# EAGLE design controller (EAGLE 9.5.2)

## Sheet 1 of 5: Power
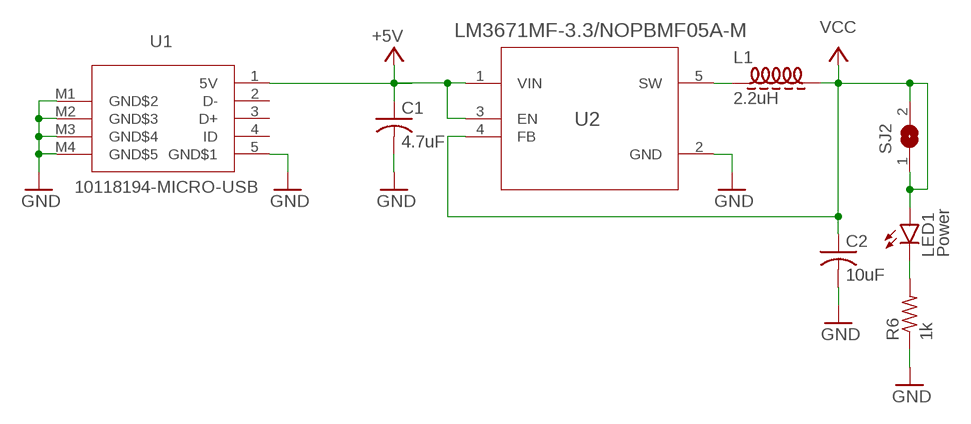
[diagram p0: schematic, sheet 1]

### Parts
C1  4.7uF  C-USC0805  [C0805]
C2  10uF  C-USC0805  [C0805]
L1  2.2uH  IND-0805  [R0805]
LED1  Power  LEDCHIPLED_0805  [CHIPLED_0805]
R6  1k  R-US_R0805  [R0805]
SJ2  SJ  [SJ]
U1  10118194-MICRO-USB  [10118194-MICRO-USB]
U2  LM3671MF-3.3/NOPBMF05A-M  [MF05A-M]

### Nets
+5V: C1.1 U1.1(5V) U2.1(VIN) U2.3(EN) ; also sheet 3
GND: C1.2 C2.2 R6.1 U1.5(GND$1) U1.M1(GND$2) U1.M2(GND$3) U1.M3(GND$4) U1.M4(GND$5) U2.2(GND) ; also sheet 2,3,4,5
N$1: L1.1 U2.5(SW)
N$10: LED1.C R6.2
VCC: C2.1 L1.2 LED1.A SJ2.1 SJ2.2 U2.4(FB) ; also sheet 2,3,4,5
Unconnected: U1.2(D-) U1.3(D+) U1.4(ID)

## Sheet 2 of 5: ESP
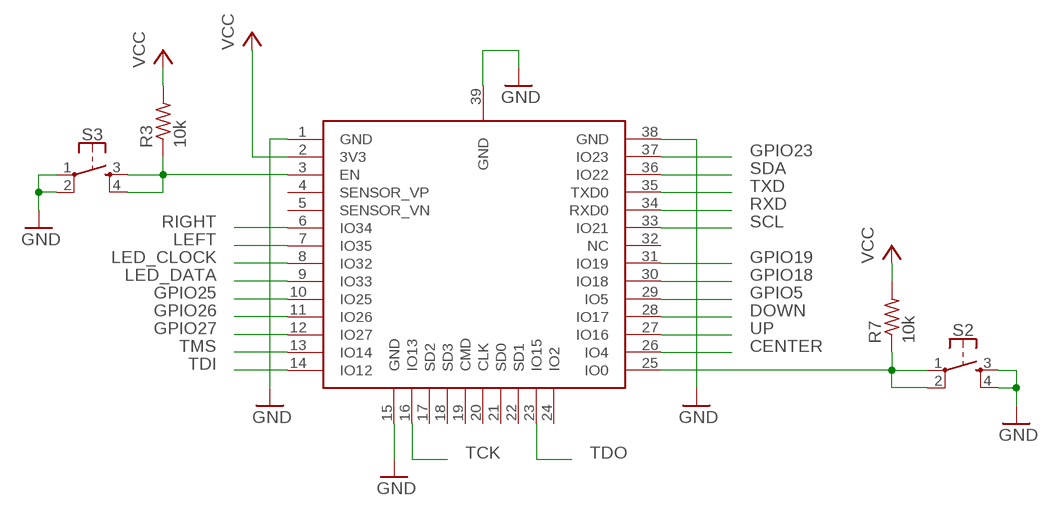
[diagram p1: schematic, sheet 2]

### Parts
R3  10k  R-US_R0805  [R0805]
R7  10k  R-US_R0805  [R0805]
S2  MOMENTARY-SWITCH-SPST-2-SMD-4.6X2.8MM  [TACTILE_SWITCH_SMD_4.6X2.8MM]
S3  MOMENTARY-SWITCH-SPST-2-SMD-4.6X2.8MM  [TACTILE_SWITCH_SMD_4.6X2.8MM]
U$2  ESP32-WROOM-32D  [ESP32-WROOM-32D]

### Nets
CENTER: U$2.26(IO4) ; also sheet 4
DOWN: U$2.28(IO17) ; also sheet 4
EN: R3.1 S3.3 S3.4 U$2.3(EN)
GND: S2.3 S2.4 S3.1 S3.2 U$2.1(GND) U$2.15(GND) U$2.38(GND) U$2.39(GND) ; also sheet 1,3,4,5
GPIO5: U$2.29(IO5) ; also sheet 5
GPIO18: U$2.30(IO18) ; also sheet 5
GPIO19: U$2.31(IO19) ; also sheet 5
GPIO23: U$2.37(IO23) ; also sheet 5
GPIO25: U$2.10(IO25) ; also sheet 5
GPIO26: U$2.11(IO26) ; also sheet 5
GPIO27: U$2.12(IO27) ; also sheet 5
IO0: R7.1 S2.1 S2.2 U$2.25(IO0)
LED_CLOCK: U$2.8(IO32) ; also sheet 3
LED_DATA: U$2.9(IO33) ; also sheet 3
LEFT: U$2.7(IO35) ; also sheet 4
RIGHT: U$2.6(IO34) ; also sheet 4
RXD: U$2.34(RXD0) ; also sheet 5
SCL: U$2.33(IO21) ; also sheet 4
SDA: U$2.36(IO22) ; also sheet 4
TCK: U$2.16(IO13) ; also sheet 5
TDI: U$2.14(IO12) ; also sheet 5
TDO: U$2.23(IO15) ; also sheet 5
TMS: U$2.13(IO14) ; also sheet 5
TXD: U$2.35(TXD0) ; also sheet 5
UP: U$2.27(IO16) ; also sheet 4
VCC: R3.2 R7.2 U$2.2(3V3) ; also sheet 1,3,4,5
Unconnected: U$2.4(SENSOR_VP) U$2.5(SENSOR_VN) U$2.17(SD2) U$2.18(SD3) U$2.19(CMD) U$2.20(CLK) U$2.21(SD0) U$2.22(SD1) U$2.24(IO2) U$2.32(NC)

## Sheet 3 of 5: LED
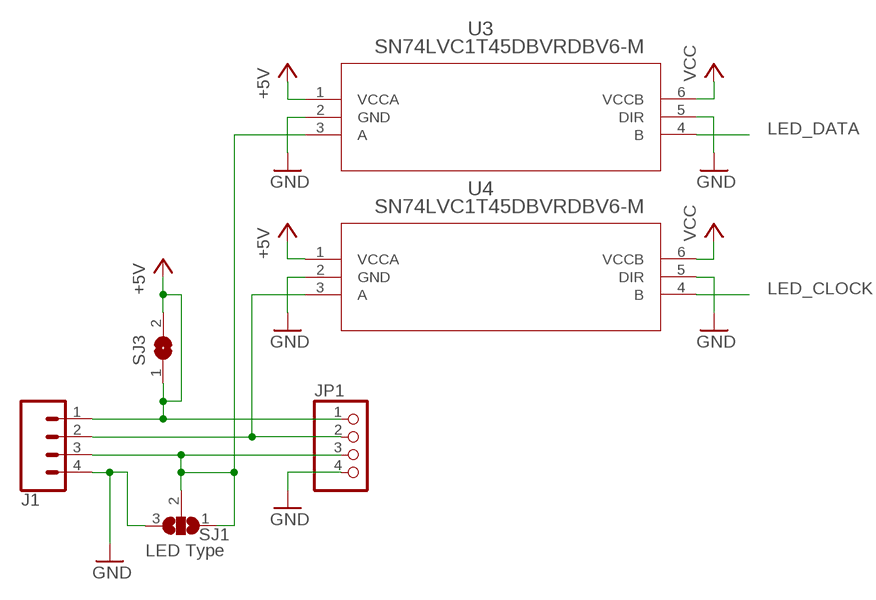
[diagram p2: schematic, sheet 3]

### Parts
J1  CONN_04SCREW  [SCREWTERMINAL-3.5MM-4]
JP1  PINHD-1X4  [1X04]
SJ1  LED Type  SJ2W  [SJ_2]
SJ3  SJ  [SJ]
U3  SN74LVC1T45DBVRDBV6-M  [DBV6-M]
U4  SN74LVC1T45DBVRDBV6-M  [DBV6-M]

### Nets
+5V: J1.1 JP1.1 SJ3.1 SJ3.2 U3.1(VCCA) U4.1(VCCA) ; also sheet 1
GND: J1.4 JP1.4 SJ1.3 U3.2(GND) U3.5(DIR) U4.2(GND) U4.5(DIR) ; also sheet 1,2,4,5
LED_CLOCK: U4.4(B) ; also sheet 2
LED_DATA: U3.4(B) ; also sheet 2
N$7: J1.3 JP1.3 SJ1.1 SJ1.2 U3.3(A)
N$9: J1.2 JP1.2 U4.3(A)
VCC: U3.6(VCCB) U4.6(VCCB) ; also sheet 1,2,4,5

## Sheet 4 of 5: UI
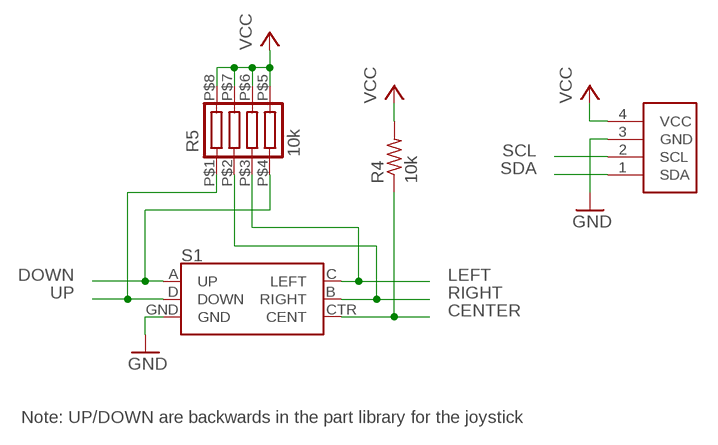
[diagram p3: schematic, sheet 4]

### Parts
R4  10k  R-US_R0805  [R0805]
R5  10k  744C083  [2012-4N-CONCAVE]
S1  JOYSTICK_MINI  [JOYSTICK_MINI]
U$5  SSD1306-OLED  [SSD1306-OLED]

### Nets
CENTER: R4.1 S1.CTR(CENT) ; also sheet 2
DOWN: R5.P$4 S1.A(UP) ; also sheet 2
GND: S1.GND U$5.3(GND) ; also sheet 1,2,3,5
LEFT: R5.P$3 S1.C(LEFT) ; also sheet 2
RIGHT: R5.P$2 S1.B(RIGHT) ; also sheet 2
SCL: U$5.2(SCL) ; also sheet 2
SDA: U$5.1(SDA) ; also sheet 2
UP: R5.P$1 S1.D(DOWN) ; also sheet 2
VCC: R4.2 R5.P$5 R5.P$6 R5.P$7 R5.P$8 U$5.4(VCC) ; also sheet 1,2,3,5

### Notes on the sheet
- Note: UP/DOWN are backwards in the part library for the joystick

## Sheet 5 of 5: Extension Headers
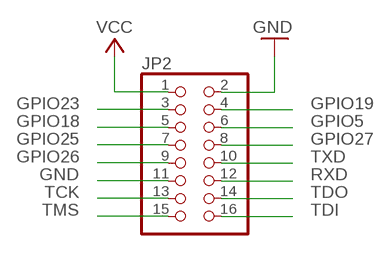
[diagram p4: schematic, sheet 5]

### Parts
JP2  PINHD-2X8  [2X08]

### Nets
GND: JP2.2 JP2.11 ; also sheet 1,2,3,4
GPIO5: JP2.6 ; also sheet 2
GPIO18: JP2.5 ; also sheet 2
GPIO19: JP2.4 ; also sheet 2
GPIO23: JP2.3 ; also sheet 2
GPIO25: JP2.7 ; also sheet 2
GPIO26: JP2.9 ; also sheet 2
GPIO27: JP2.8 ; also sheet 2
RXD: JP2.12 ; also sheet 2
TCK: JP2.13 ; also sheet 2
TDI: JP2.16 ; also sheet 2
TDO: JP2.14 ; also sheet 2
TMS: JP2.15 ; also sheet 2
TXD: JP2.10 ; also sheet 2
VCC: JP2.1 ; also sheet 1,2,3,4

## Library data of the parts
C1 C2 = rcl:C-US: CAPACITOR, American symbol; SPICEPREFIX: C
J1 = SparkFun-Connectors:CONN_04: Multi connection point. Often used as Generic Header-pin footprint for 0.1 inch spaced/style header connections On any of the 0.1 inch spaced packages, you can populate with these: Break Away Headers - Straight <https://www.sparkfun.com/products/116> (PRT-00116) Break Away Male Headers - Right Angle <https://www.sparkfun.com/products/553> (PRT-00553) Female Headers <https://www.sparkfun.com/products/115> (PRT-00115) Break Away Headers - Machine Pin <https://www.sparkfun.com/products/117> (PRT-00117) Break Away Female Headers - Swiss Machine Pin <https://www.sparkfun.com/products/743> (PRT-00743) For SCREWTERMINALS and SPRING TERMINALS visit here: Screw Terimnals on SparkFun.com <https://www.sparkfun.com/search/results?term=Screw+Terminals> (5mm/3.5mm/2.54mm spacing) This device is also useful as a general connection point to wire up your design to another part of your project. Our various solder wires solder well into these plated through hole pads. Hook-Up Wire - Assortment (Stranded, 22 AWG) <https://www.sparkfun.com/products/11375> (PRT-11375) Hook-Up Wire - Assortment (Solid Core, 22 AWG) <https://www.sparkfun.com/products/11367> (PRT-11367) View the entire wire category on our website here <https://www.sparkfun.com/categories/141> Special notes: Molex polarized connector foot print use with SKU : PRT-08231 with associated crimp pins and housings. 1MM SMD Version SKU: PRT-10208; PROD_ID: 2xCONN-08399; SF_ID: 2xPRT-08084
JP1 = pinhead:PINHD-1X4: PIN HEADER
JP2 = pinhead:PINHD-2X8: PIN HEADER
L1 = nebrius:IND-0805
LED1 = led:LED: LED OSRAM: - CHIPLED LG R971, LG N971, LY N971, LG Q971, LY Q971, LO R971, LY R971 LH N974, LH R974 LS Q976, LO Q976, LY Q976 LO Q996 - Hyper CHIPLED LW Q18S LB Q993, LB Q99A, LB R99A - SideLED LS A670, LO A670, LY A670, LG A670, LP A670 LB A673, LV A673, LT A673, LW A673 LH A674 LY A675 LS A676, LA A676, LO A676, LY A676, LW A676 LS A679, LY A679, LG A679 - Hyper Micro SIDELED® LS Y876, LA Y876, LO Y876, LY Y876 LT Y87S - SmartLED LW L88C, LW L88S LB L89C, LB L89S, LG L890 LS L89K, LO L89K, LY L89K LS L896, LA L896, LO L896, LY L896 - TOPLED LS T670, LO T670, LY T670, LG T670, LP T670 LSG T670, LSP T670, LSY T670, LOP T670, LYG T670 LG T671, LOG T671, LSG T671 LB T673, LV T673, LT T673, LW T673 LH T674 LS T676, LA T676, LO T676, LY T676, LB T676, LH T676, LSB T676, LW T676 LB T67C, LV T67C, LT T67C, LS T67K, LO T67K, LY T67K, LW E67C LS E67B, LA E67B, LO E67B, LY E67B, LB E67C, LV E67C, LT E67C LW T67C LS T679, LY T679, LG T679 LS T770, LO T770, LY T770, LG T770, LP T770 LB T773, LV T773, LT T773, LW T773 LH T774 LS E675, LA E675, LY E675, LS T675 LS T776, LA T776, LO T776, LY T776, LB T776 LHGB T686 LT T68C, LB T68C - Hyper Mini TOPLED® LB M676 - Mini TOPLED Santana® LG M470 LS M47K, LO M47K, LY M47K Source: http://www.osram.convergy.de LUXEON: - LUMILED® LXK2-PW12-R00, LXK2-PW12-S00, LXK2-PW14-U00, LXK2-PW14-V00 LXK2-PM12-R00, LXK2-PM12-S00, LXK2-PM14-U00 LXK2-PE12-Q00, LXK2-PE12-R00, LXK2-PE12-S00, LXK2-PE14-T00, LXK2-PE14-U00 LXK2-PB12-K00, LXK2-PB12-L00, LXK2-PB12-M00, LXK2-PB14-N00, LXK2-PB14-P00, LXK2-PB14-Q00 LXK2-PR12-L00, LXK2-PR12-M00, LXK2-PR14-Q00, LXK2-PR14-R00 LXK2-PD12-Q00, LXK2-PD12-R00, LXK2-PD12-S00 LXK2-PH12-R00, LXK2-PH12-S00 LXK2-PL12-P00, LXK2-PL12-Q00, LXK2-PL12-R00 Source: www.luxeon.com KINGBRIGHT: KA-3528ASYC Source: www.kingbright.com
R3 R4 R6 R7 = rcl:R-US_: RESISTOR, American symbol; SPICEPREFIX: R
R5 = nebrius:744C083
S1 = SparkFun-Switches:JOYSTICK_MINI: Small Tactile Joystick w/ Select Switch A 5-way tactile switch allows for a joystick-like interface in a very small package. Part #: 4UCON SF303GJ26 SparkFun Products 5-way Tactile Switch <https://www.sparkfun.com/products/10063> (COM-10063) Used on SparkFun Block for Intel® Edison - OLED <https://www.sparkfun.com/products/13035> (DEV-13035) Used on CAN-BUS Shield <https://www.sparkfun.com/products/13262> (DEV-13262); PROD_ID: SWCH-09905; SF_SKU: COM-10063
S2 S3 = SparkFun-Switches:MOMENTARY-SWITCH-SPST-2: Momentary Switch (Pushbutton) - SPST - Two Circuits Normally-open (NO) SPST momentary switches (buttons, pushbuttons). Schematic symbol includes two switch circuits. Variants SMD-4.6MMX2.8MM - 4.60mm x 2.80mm Tactile Momentary Button Switch - Used on SparkFun SAMD21 Mini Breakout <https://www.sparkfun.com/products/13664> SMD-5.2MM - Mini Pushbutton Switch - SMD <https://www.sparkfun.com/products/8720> - Used on Arduino Pro Mini <https://www.sparkfun.com/products/11114>; PROD_ID: SWCH-13065
SJ1 = jumper:SJ2W: SMD solder JUMPER
SJ2 SJ3 = jumper:SJ: SMD solder JUMPER
U1 = nebrius:10118194-MICRO-USB: Surface mount micro USB connector
U2 = nebrius:LM3671MF-3.3/NOPB; MANUFACTURER_PART_NUMBER: LM3671MF3.3NOPB; VENDOR: Texas Instruments
U3 U4 = nebrius:SN74LVC1T45DBVR; MANUFACTURER_PART_NUMBER: SN74LVC1T45DBVR; VENDOR: Texas Instruments
U$2 = nebrius:ESP32-WROOM-32D
U$5 = nebrius:SSD1306-OLED

## Board
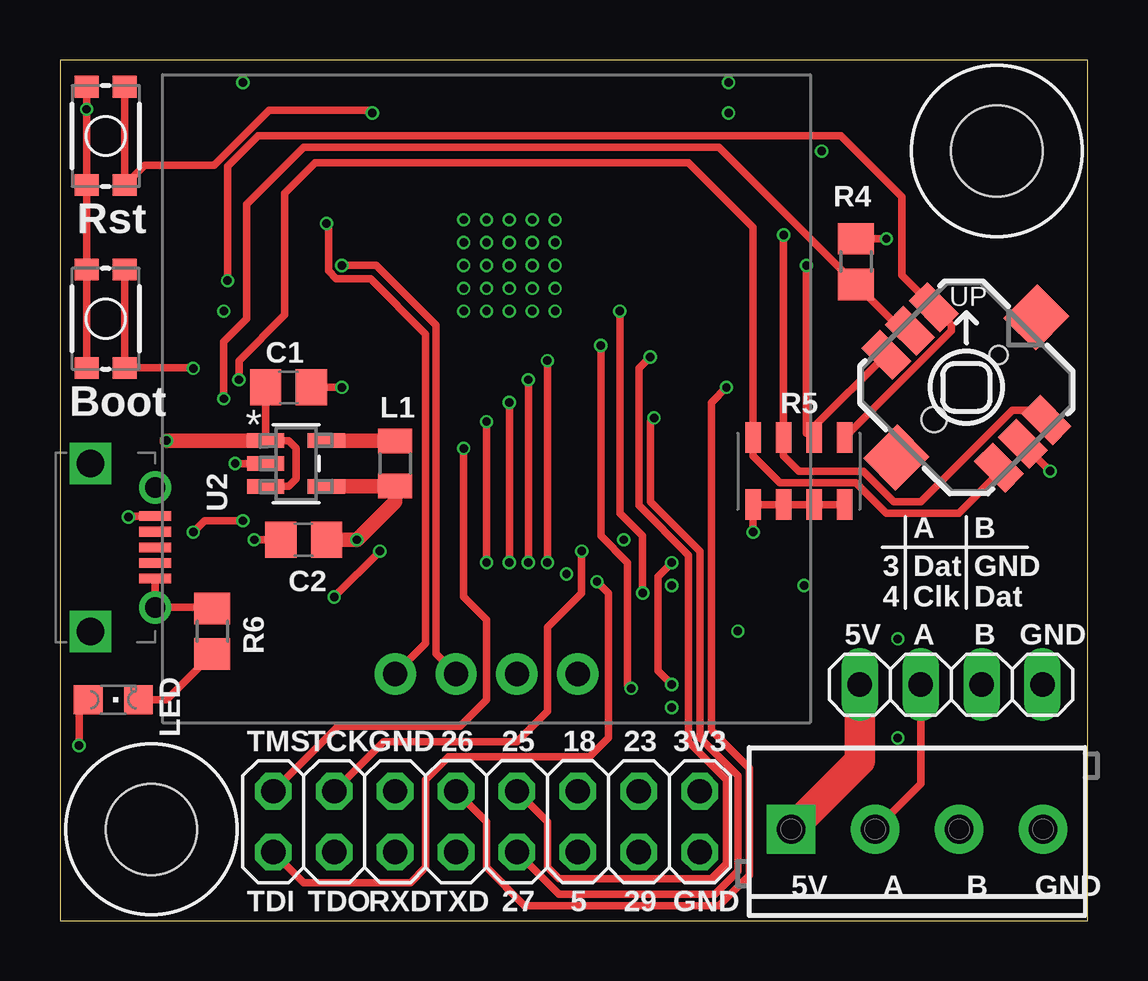
[diagram p5: board, top side]
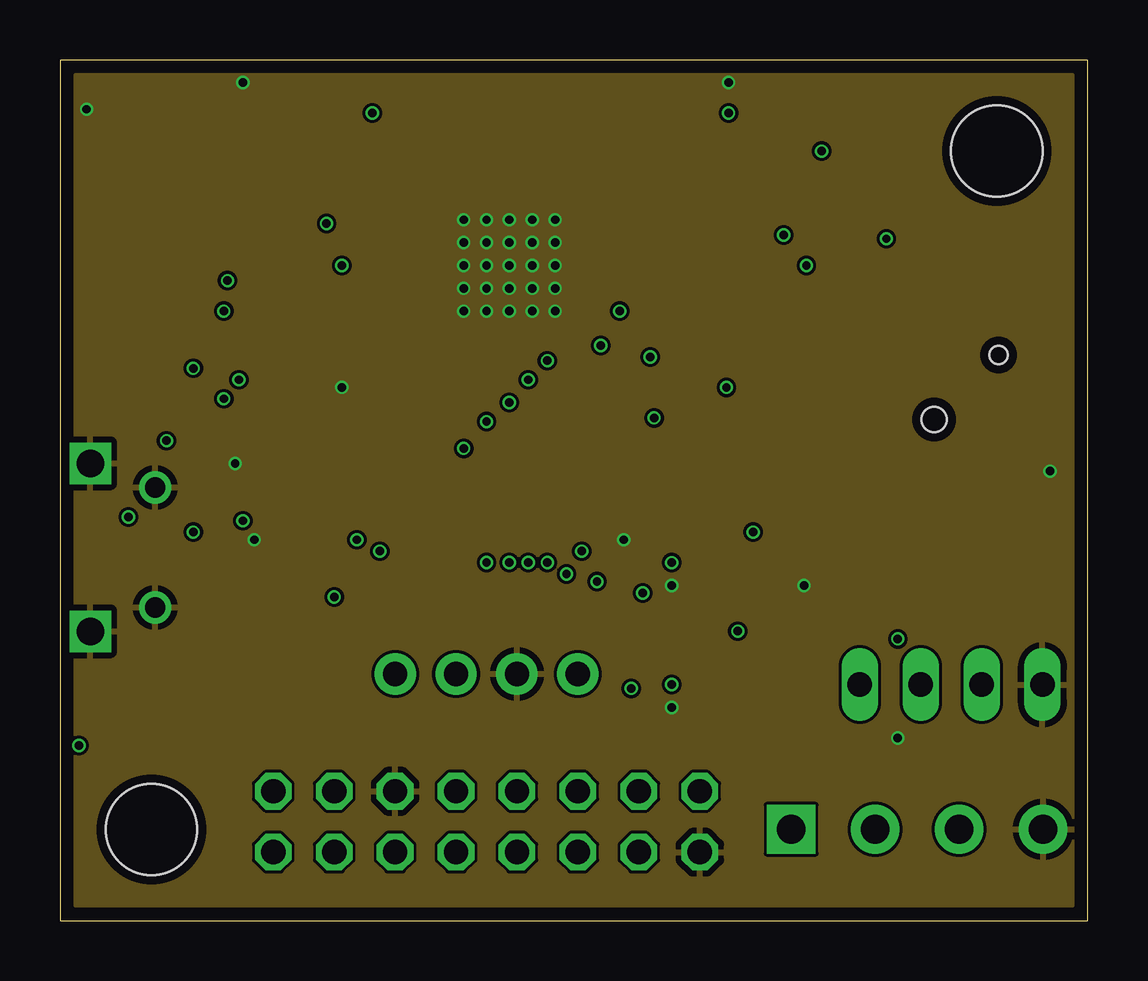
[diagram p6: board, inner layer Route2]
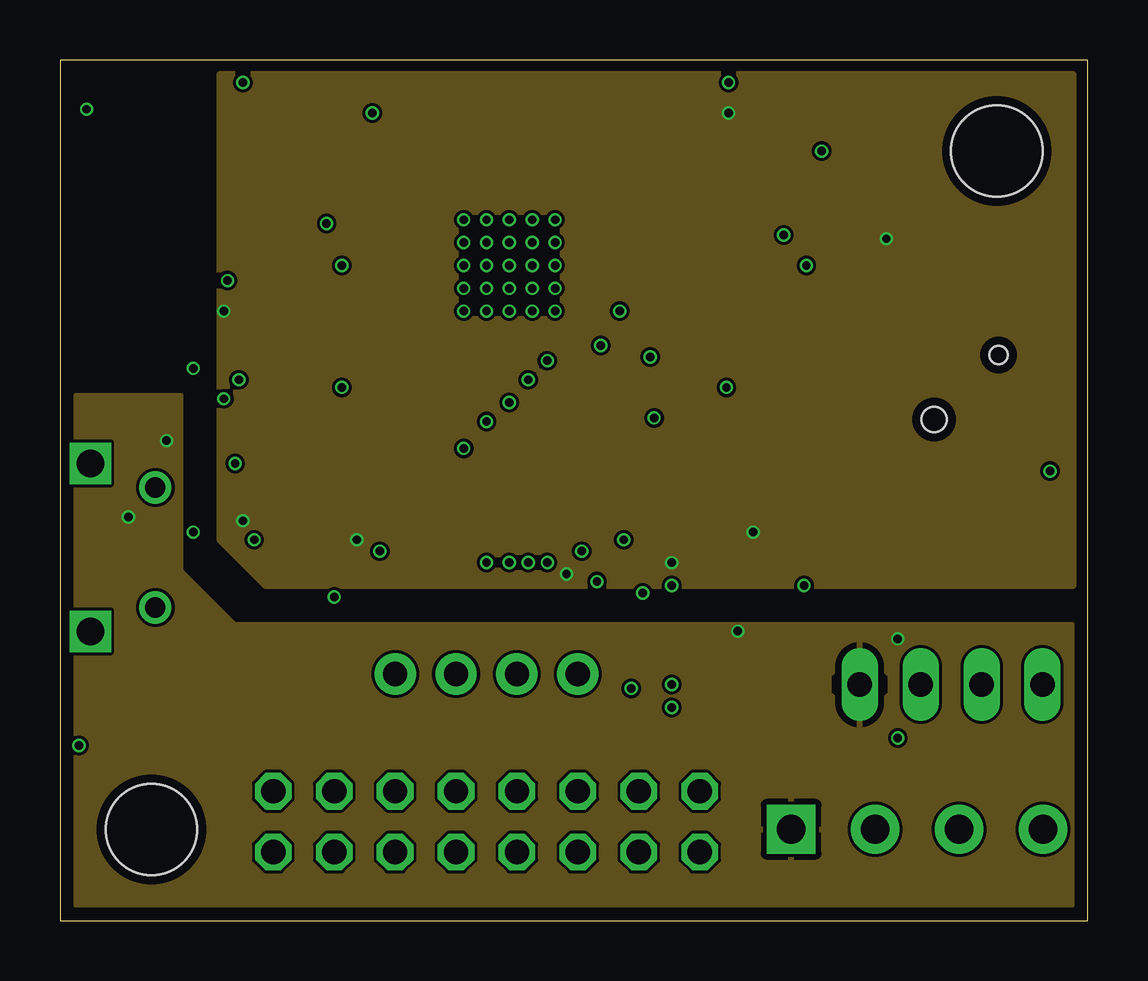
[diagram p7: board, inner layer Route15]
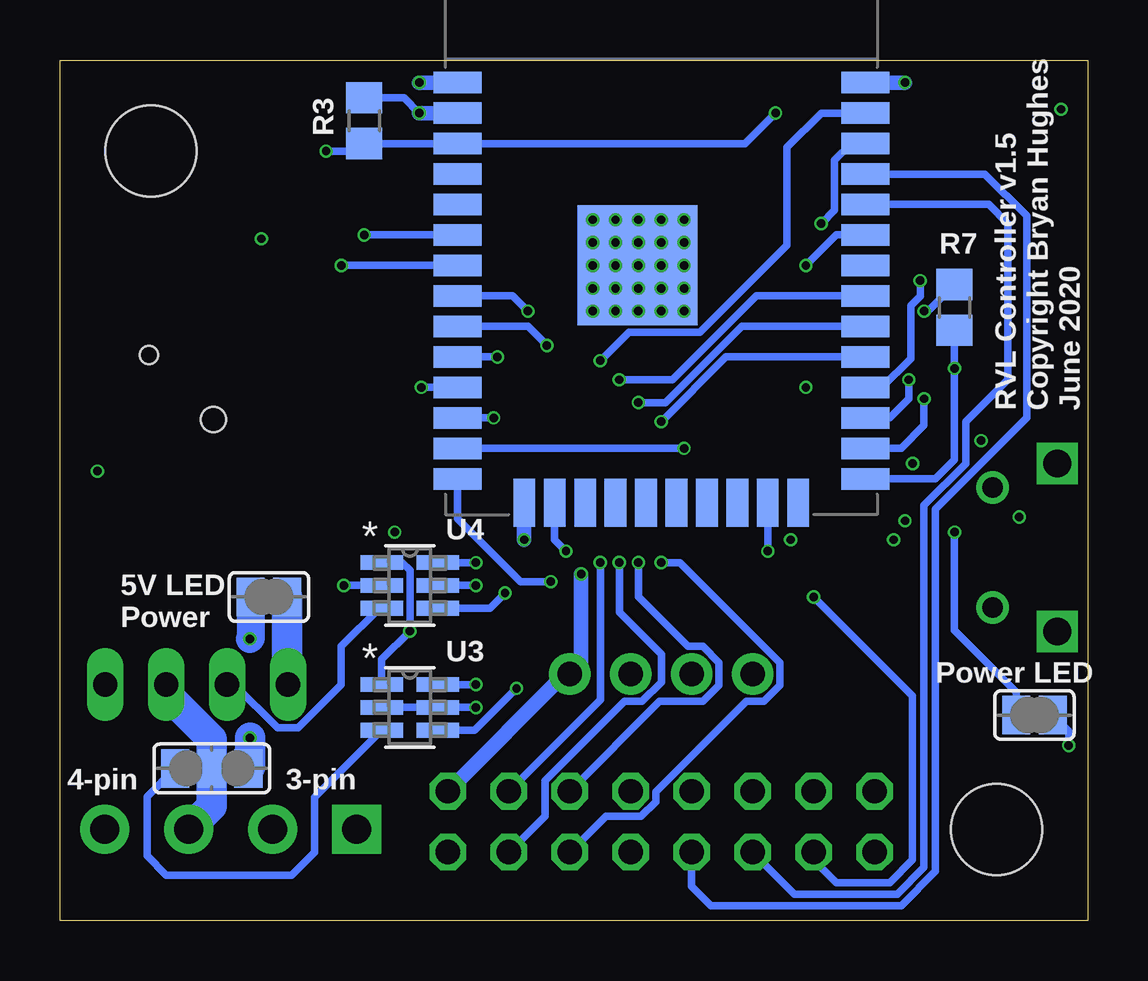
[diagram p8: board, bottom side, seen from below]

Size 42.84 x 35.87 mm. Coordinates in mm from the lower left corner, seen from the top.
Outline: 0,0 42.84,0 42.84,35.87 0,35.87 0,0
Copper layers (1*2*15*16): Top 0.035559375mm / dielectric 0.17018125mm / Route2 0.01778125mm / dielectric 47mil / Route15 0.01778125mm / dielectric 0.17018125mm / Bottom 0.035559375mm
Design rules "oshpark-4layer": minimum track width 5mil, minimum drill 10mil, track to track 5mil, track to pad 5mil, pad to pad 5mil, via to via 5mil, smd to smd 5mil, copper to edge 15mil, drill to drill 6mil, minimum pad ring 4mil, minimum via ring 4mil, stop-mask expansion 2.5mil, vias tented up to drill 0mil, thermal gap 10mil
Holes 3.8 mm at 3.81,3.81 39.05,32.07

### Footprints (pad centres in the part's own frame; a part is rotated, then mirrored left to right if it is on the bottom)
C0805 = smd 1.3 x 1.5: 1 -0.95,0; 2 0.95,0
SCREWTERMINAL-3.5MM-4 = drill 1.2 pad 2.032 square: 1 0,0 | drill 1.2 pad 2.032: 2 3.5,0; 3 7,0; 4 10.5,0
1X04 = drill 1.016 long: 1 -3.81,0; 2 -1.27,0; 3 1.27,0; 4 3.81,0
2X08 = drill 1.016 octagon: 1 -8.89,-1.27; 2 -8.89,1.27; 3 -6.35,-1.27; 4 -6.35,1.27; 5 -3.81,-1.27; 6 -3.81,1.27; 7 -1.27,-1.27; 8 -1.27,1.27; 9 1.27,-1.27; 10 1.27,1.27; 11 3.81,-1.27; 12 3.81,1.27; 13 6.35,-1.27; 14 6.35,1.27; 15 8.89,-1.27; 16 8.89,1.27
R0805 = smd 1.02 x 1.4: 1 -0.94,0; 2 0.94,0
CHIPLED_0805 = smd 1.2 x 1.2: A 0,-1.05; C 0,1.05
R0805' = smd 1.3 x 1.5: 1 -0.95,0; 2 0.95,0
2012-4N-CONCAVE = smd 0.65 x 1.27: P$1 -1.905,1.397; P$2 -0.635,1.397; P$3 0.635,1.397; P$4 1.905,1.397; P$5 1.905,-1.397; P$6 0.635,-1.397; P$7 -0.635,-1.397; P$8 -1.905,-1.397
JOYSTICK_MINI = smd 1.85 x 1.1: A -3.325,1.4; B 3.325,1.4; C -3.325,-1.4; CTR -3.325,0; D 3.325,-1.4; GND 3.325,0 | smd 1.9 x 2: NC 0,4.13; NC@0 0,-4.13 | hole 0.75: 0,1.9 | hole 1.05: 0,-1.9
TACTILE_SWITCH_SMD_4.6X2.8MM = smd 0.9 x 1: 1 -2.05,-0.8; 2 2.05,-0.8; 3 2.05,0.8; 4 -2.05,0.8
SJ_2 = smd 1.168 x 1.6: 1 -1.524,0; 2 0,0; 3 1.524,0
SJ = smd 1.168 x 1.6: 1 -0.762,0; 2 0.762,0
10118194-MICRO-USB = smd 0.4 x 1.35: 1 -1.3,2.7; 2 -0.65,2.7; 3 0,2.7; 4 0.65,2.7; 5 1.3,2.7 | drill 0.85 pad 1.35: M1 -2.5,2.7; M2 2.5,2.7 | drill 1.15 pad 1.55 square: M3 -3.5,0; M4 3.5,0
MF05A-M = smd 1.559 x 0.608: 1 -1.269,0.953; 2 -1.269,0; 3 -1.269,-0.953; 4 1.269,-0.953; 5 1.269,0.953
DBV6-M = smd 1.778 x 0.61: 1 -1.168,0.95; 2 -1.168,0; 3 -1.168,-0.95; 4 1.168,-0.95; 5 1.168,0; 6 1.168,0.95
ESP32-WROOM-32D = smd 2 x 0.9: 1 -8.5,0; 2 -8.5,-1.27; 3 -8.5,-2.54; 4 -8.5,-3.81; 5 -8.5,-5.08; 6 -8.5,-6.35; 7 -8.5,-7.62; 8 -8.5,-8.89; 9 -8.5,-10.16; 10 -8.5,-11.43; 11 -8.5,-12.7; 12 -8.5,-13.97; 13 -8.5,-15.24; 14 -8.5,-16.51; 25 8.5,-16.51; 26 8.5,-15.24; 27 8.5,-13.97; 28 8.5,-12.7; 29 8.5,-11.43; 30 8.5,-10.16; 31 8.5,-8.89; 32 8.5,-7.62; 33 8.5,-6.35; 34 8.5,-5.08; 35 8.5,-3.81; 36 8.5,-2.54; 37 8.5,-1.27; 38 8.5,0 | smd 0.9 x 2: 15 -5.715,-17.51; 16 -4.445,-17.51; 17 -3.175,-17.51; 18 -1.905,-17.51; 19 -0.635,-17.51; 20 0.635,-17.51; 21 1.905,-17.51; 22 3.175,-17.51; 23 4.445,-17.51; 24 5.715,-17.51 | smd 5 x 5: 39 -1,-7.62
SSD1306-OLED = drill 1.016 pad 1.727: 1 -3.81,2.032; 2 -1.27,2.032; 3 1.27,2.032; 4 3.81,2.032

### Placement (x,y rotation side)
C1  9.53,22.23 0 top
C2  10.16,15.88 180 top
J1  30.48,3.81 0 top
JP1  37.15,9.84 0 top
JP2  17.78,4.13 180 top
L1  13.97,19.05 270 top
LED1  2.22,9.21 270 top
R3  10k  [R0805']  30.16,33.34 90 bottom
R4  10k  [R0805']  33.18,27.46 90 top
R5  30.8,18.73 0 top
R6  1k  [R0805']  6.35,12.07 270 top
R7  10k  [R0805']  5.56,25.56 90 bottom
S1  37.78,22.23 315 top
S2  1.91,25.08 90 top
S3  1.91,32.7 270 top
SJ1  36.51,6.35 0 bottom
SJ2  2.22,8.57 0 bottom
SJ3  34.13,13.49 180 bottom
U1  1.27,15.56 270 top
U2  9.84,19.05 0 top
U3  28.26,8.89 0 bottom
U4  28.26,13.97 0 bottom
U$2  17.78,34.93 0 bottom
U$5  17.78,8.26 0 top

### Tracks (layer width: path | path; a pad name or v marks a point on that pad's centre or on a via)
+5V  (via drill 0.35)
  Top 0.305: U2.3 9.53,18.1 9.84,18.41 9.84,19.69 9.53,20 U2.1 C1.1 | U1.1 2.89,16.86 v2.86,16.83
  Top 0.61: v4.44,20 U2.1
  Top 1.27: JP1.1 33.34,6.67 J1.1
  Bottom 0.305: U4.1 28.57,14.92 28.26,14.61 v28.26,12.07 29.43,10.9 U3.1
  Bottom 0.61: SJ3.1 SJ3.2
  Bottom 1.168: SJ3.2 34.89,11.78 v34.92,11.75
  Bottom 1.27: SJ3.1 33.37,9.87 JP1.1
  pour Route15: 42.23,0.64 42.23,12.38 7.3,12.38 5.08,14.61 5.08,21.91 0.64,21.91 0.64,0.64
CENTER  (via drill 0.35)
  Top 0.305: S1.CTR 35.12,24.58 R4.1 27.47,32.23 10.16,32.23 7.78,29.85 7.78,25.08 6.83,24.13 v6.83,21.75
  Bottom 0.305: U$2.26 7.78,19.69 6.83,20.64 v6.83,21.75
DOWN  (via drill 0.35)
  Top 0.305: v6.98,26.67 6.98,31.43 8.25,32.7 32.54,32.7 35.08,30.16 35.08,26.9 S1.A 37.15,24.84 37.15,24.58 R5.P$4
  Bottom 0.305: v6.98,26.67 6.98,26.03 7.38,25.63 7.38,23.41 8.57,22.23 U$2.28
EN  (via drill 0.35)
  Top 0.305: v13.02,33.66 12.9,33.77 8.71,33.77 6.43,31.49 3.54,31.49 S3.3 S3.4
  Bottom 0.305: v31.75,32.07 30.48,32.07 R3.1 U$2.3 14.29,32.38 v13.02,33.66
GND  (via drill 0.35)
  Top 0.305: U1.5 U1.M2 6.31,13.06 R6.1 | U2.2 v7.3,19.05 | C1.2 v11.75,22.23 | S2.4 S2.3 S3.2 v1.11,33.81 v1.11,33.82 S3.1 | C2.2 v8.1,15.88 | S1.GND v41.28,18.73 | v41.28,18.73
  Bottom 0.305: v25.5,13.97 U4.5 | U4.2 v31.01,13.97 | v25.5,8.89 U3.5 U3.2
  Bottom 0.61: U$2.1 v27.87,34.93 | U$2.15 v23.5,15.88 | U$2.38 v7.62,34.93 | U$2.39 18.73,27.26 v18.73,26.35
  Bottom 1.27: SJ1.3 34.92,6.41 v34.92,7.62
  other vias: 16.83,29.21 16.83,28.26 17.78,26.35 16.83,27.3 16.83,26.35 16.83,25.4 17.78,25.4 18.73,25.4 19.69,25.4 20.64,25.4 17.78,27.3 17.78,28.26 17.78,29.21 18.73,29.21 18.73,28.26 18.73,27.3 19.69,26.35 19.69,27.3 19.69,28.26 19.69,29.21 20.64,29.21 20.64,28.26 20.64,27.3 20.64,26.35
  pour Route2: 0.64,35.24 42.23,35.24 42.23,0.64 0.64,0.64
GPIO5  (via drill 0.35)
  Top 0.305: v17.78,14.92 v17.78,20.8
  Bottom 0.305: JP2.6 20.09,4.36 18.62,4.36 18.01,4.97 18.01,5.37 14.24,9.14 13.5,9.14 12.83,9.81 12.83,10.76 16.99,14.92 v17.78,14.92 | U$2.29 15.08,23.49 v17.78,20.8
GPIO18  (via drill 0.35)
  Top 0.305: v18.73,14.92 v18.73,21.59
  Bottom 0.305: JP2.5 17.84,9.14 16.04,9.14 15.37,9.81 15.37,10.76 16.04,11.43 16.67,11.43 18.73,13.49 v18.73,14.92 | v18.73,21.59 17.6,21.59 15.39,23.8 15.26,23.93 14.42,24.77 U$2.30
GPIO19  (via drill 0.35)
  Top 0.305: v19.53,14.92 v19.53,22.54
  Bottom 0.305: JP2.4 22.63,4.36 22.63,5.83 19.32,9.14 18.58,9.14 17.78,9.94 17.78,11.11 19.53,12.86 v19.53,14.92 | v19.53,22.54 17.3,22.54 13.81,26.04 U$2.31
GPIO23  (via drill 0.35)
  Top 0.305: v20.32,14.92 v20.32,23.34
  Bottom 0.305: JP2.3 20.32,9.21 v20.32,14.92 | v20.32,23.34 19.13,24.53 16.16,24.53 12.54,28.15 12.54,32.23 11.11,33.66 U$2.37
GPIO25  (via drill 0.35)
  Top 0.305: JP2.7 20.32,4.13 20.32,2.22 20.8,1.75 27.15,1.75 27.78,2.38 27.78,5.87 26.19,7.46 26.19,15.24 24.13,17.3 24.13,23.02 v24.61,23.49
  Bottom 0.305: v24.61,23.49 U$2.10
GPIO26  (via drill 0.35)
  Top 0.305: JP2.9 17.78,4.13 17.78,2.22 19.37,0.64 27.46,0.64 28.73,1.91 28.73,6.35 27.15,7.94 27.15,11.11 27.15,21.59 v27.78,22.23
  Bottom 0.305: v27.78,22.23 U$2.11
GPIO27  (via drill 0.35)
  Top 0.305: JP2.8 20.8,1.11 27.3,1.11 28.26,2.06 28.26,6.03 26.67,7.62 26.67,15.4 24.61,17.46 24.61,20.8 v24.77,20.96
  Bottom 0.305: v24.77,20.96 U$2.12
IO0  (via drill 0.35)
  Top 0.305: S2.2 S2.1 5.54,23.03 v5.56,23.02
  Bottom 0.305: U$2.25 6.35,18.41 5.56,19.21 v5.56,23.02 R7.1
LED_CLOCK  (via drill 0.35)
  Top 0.305: v23.34,25.4 23.34,16.99 24.29,16.03 v24.29,13.65
  Bottom 0.305: U4.4 24.92,13.02 v24.29,13.65 | v23.34,25.4 23.97,26.04 U$2.8
LED_DATA  (via drill 0.35)
  Top 0.305: v23.81,9.68 23.65,9.84 23.65,14.92 22.54,16.03 v22.54,23.97
  Bottom 0.305: U3.4 25.56,7.94 v23.81,9.68 | v22.54,23.97 23.34,24.77 U$2.9
LEFT  (via drill 0.35)
  Top 0.305: v31.11,27.3 31.11,20.32 31.35,20.18 R5.P$3 31.43,20.58 S1.C
  Bottom 0.305: v31.11,27.3 U$2.7
N$1
  Top 0.61: U2.5 13.96,20 L1.1
N$2
  cutout Route15: 32.23,10.16 32.23,9.53 33.02,8.73 33.66,8.73 34.45,9.53 34.45,10.16 33.66,10.95 33.02,10.95
  cutout Route15: 29.37,4.13 29.37,3.49 30.16,2.7 30.8,2.7 31.59,3.49 31.59,4.13 30.8,4.92 30.16,4.92
N$7
  Bottom 0.305: U3.3 32.23,5.14 32.23,2.86 33.18,1.91 38.42,1.91 39.21,2.7 39.21,5.18 SJ1.1 SJ1.2
  Bottom 1.27: J1.3 36.51,4.78 SJ1.2 36.51,7.56 38.42,9.47 JP1.3
N$9
  Top 0.305: JP1.2 35.88,5.71 J1.2
  Bottom 0.305: JP1.2 35.57,9.84 33.77,8.04 32.91,8.04 31.11,9.83 31.11,11.43 29.53,13.02 U4.3
N$10
  Top 0.305: LED1.C 4.44,9.21 R6.2
RIGHT  (via drill 0.35)
  Top 0.305: v30.16,28.58 R5.P$2 30.16,19.37 30.8,18.73 33.5,18.73 34.77,17.46 35.88,17.46 39.69,21.27 40.72,21.27 S1.B
  Bottom 0.305: v30.16,28.58 U$2.6
RXD
  Bottom 0.305: U$2.34 4.13,29.85 3.33,29.05 3.33,22.54 5.08,20.8 5.08,19.05 6.83,17.3 6.83,2.22 7.94,1.11 12.22,1.11 JP2.12
SCL  (via drill 0.35)
  Top 0.305: U$5.2 15.67,11.12 15.67,24.81 13.18,27.3 v11.75,27.3
  Bottom 0.305: U$2.33 10.48,28.58 v11.75,27.3
SDA  (via drill 0.35)
  Top 0.305: U$5.1 15.24,11.56 15.24,24.45 12.94,26.75 11.52,26.75 11.19,27.08 11.19,28.97 v11.11,29.05
  Bottom 0.305: v11.11,29.05 10.56,29.6 10.56,31.68 9.86,32.38 U$2.36
TCK  (via drill 0.35)
  Top 0.305: JP2.13 13.49,7.46 19.05,7.46 20.32,8.73 20.32,12.22 21.75,13.65 v21.75,15.4
  Bottom 0.305: U$2.16 22.22,15.88 v21.75,15.4
TDI  (via drill 0.35)
  Top 0.305: JP2.16 10.16,1.59 14.61,1.59 15.24,2.22 15.24,5.87 16.19,6.83 22.07,6.83 22.86,7.62 22.86,13.65 v22.38,14.13
  Bottom 0.305: U$2.14 26.28,16.76 23.65,14.13 v22.38,14.13
TDO  (via drill 0.35)
  Top 0.305: v11.43,13.49 v13.33,15.4
  Bottom 0.305: JP2.14 11.43,2.54 10.48,1.59 8.25,1.59 7.3,2.54 7.3,9.37 v11.43,13.49 | v13.33,15.4 U$2.23
TMS  (via drill 0.35)
  Top 0.305: JP2.15 11.59,8.1 16.67,8.1 17.78,9.21 17.78,12.54 16.83,13.49 v16.83,19.69
  Bottom 0.305: v16.83,19.69 U$2.13
TXD
  Bottom 0.305: U$2.35 4.29,31.12 2.54,29.37 2.54,20.96 6.35,17.15 6.35,2.06 7.78,0.64 15.72,0.64 16.51,1.43 JP2.10
UP  (via drill 0.35)
  Top 0.305: S1.D 39.14,18.66 37.47,16.99 34.45,16.99 33.18,18.26 30,18.26 28.89,19.37 R5.P$1 28.89,28.89 26.19,31.59 10.64,31.59 9.37,30.32 9.37,25.24 7.46,23.34 v7.46,22.54
  Bottom 0.305: U$2.27 8.25,20.96 7.46,21.75 v7.46,22.54
VCC  (via drill 0.35)
  Top 0.305: v28.89,16.19 R5.P$8 R5.P$7 R5.P$6 R5.P$5 | R4.2 v34.45,28.41 v34.45,28.42 | v5.56,16.19 6.03,16.67 v7.62,16.67 | v25.5,14.92 24.92,14.34 24.92,10.42 v25.5,9.84 | v0.79,7.3 0.79,8.83 LED1.A
  Top 0.61: U2.4 11.12,18.11 L1.2 13.97,17.47 v12.38,15.88 C2.1
  Bottom 0.305: v25.5,9.84 U3.6 | v25.5,14.92 U4.6 | R3.2 28.5,34.29 v27.87,33.66 | v5.56,16.19 5.56,12.1 2.98,9.53 SJ2.1 SJ2.2 0.79,7.91 v0.79,7.3 | R7.2 6.66,25.4 v6.83,25.4
  Bottom 0.61: U$2.2 v27.87,33.66 | v21.11,14.45 21.11,10.76 U$5.4 21.78,10.29 JP2.1
  pour Route15: 42.23,13.97 8.57,13.97 6.67,15.88 6.67,35.24 42.23,35.24

### Text on the board
tPlace: Rst | Boot | A | B | 3 | Dat | GND | 4 | Clk | Dat | 5V | A | B | GND | TMS | TCK | GND | 26 | 25 | 18 | 23 | 3V3 | TDI | TDO | RXD | TXD | 27 | 5 | 29 | GND | 5V | A | B | GND
bPlace: RVL Controller v1.5 / Copyright Bryan Hughes / June 2020 | 5V LED / Power | Power LED | 3-pin | 4-pin
tNames: LED